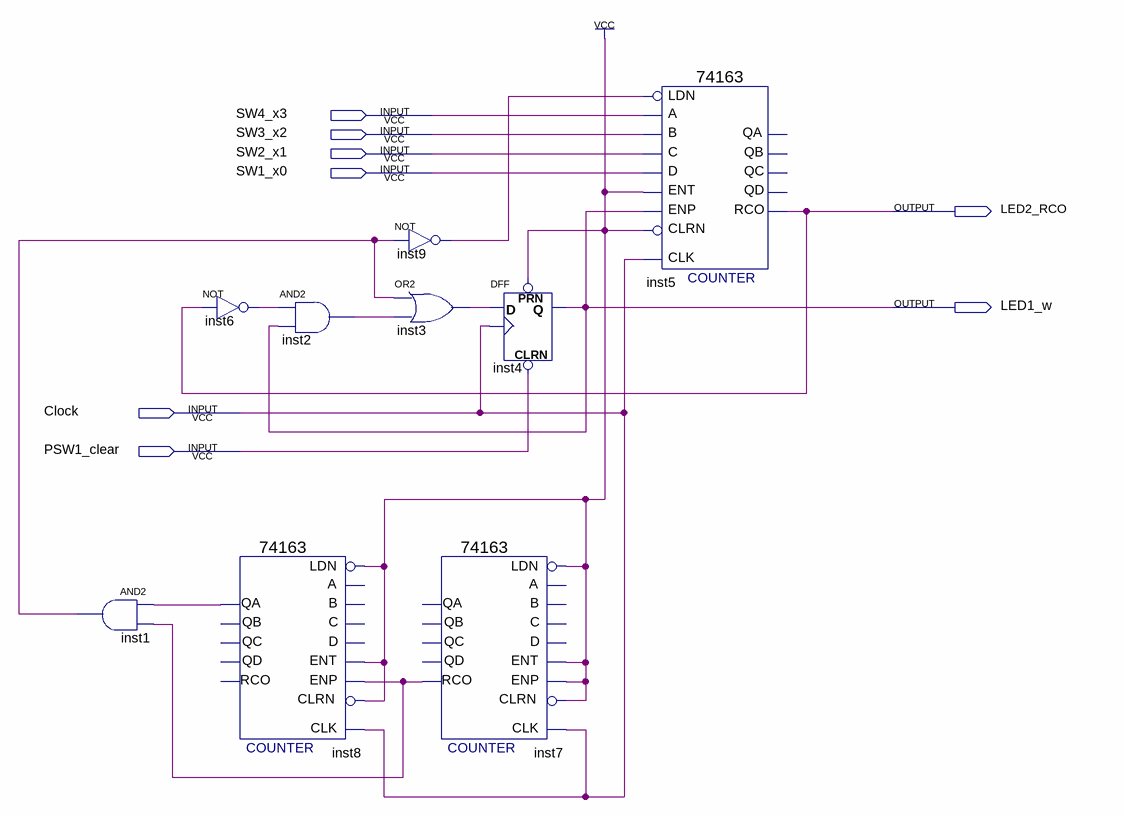
[diagram p0: schematic sheet]
// Quartus schematic q6_a.bdf as structural Verilog: 9 symbols, 8 pins
module q6_a (
  input  SW4_x3,
  input  SW3_x2,
  input  SW2_x1,
  input  SW1_x0,
  input  Clock,
  input  PSW1_clear,
  output LED2_RCO,
  output LED1_w
);

  wire inst1_out, inst2_out, inst3_out, inst6_out, inst7_rco, inst8_qa, inst9_out;

  and inst1 (inst1_out, inst8_qa, inst7_rco);
  not inst6 (inst6_out, LED2_RCO);
  \74163  inst8 (
    .ENT(1'b1), .CLRN(1'b1), .CLK(Clock), .ENP(inst7_rco), .LDN(1'b1), .QA(inst8_qa));  // open: C, B, A, D, QB, QC, QD, RCO
  and inst2 (inst2_out, inst6_out, LED1_w);
  not inst9 (inst9_out, inst1_out);
  or inst3 (inst3_out, inst1_out, inst2_out);
  \74163  inst7 (
    .ENT(1'b1), .CLRN(1'b1), .CLK(Clock), .ENP(1'b1), .LDN(1'b1), .RCO(inst7_rco));  // open: C, B, A, D, QA, QB, QC, QD
  DFF inst4 (.CLRN(PSW1_clear), .CLK(Clock), .D(inst3_out), .PRN(1'b1), .Q(LED1_w));
  \74163  inst5 (
    .C(SW2_x1), .B(SW3_x2), .A(SW4_x3), .ENT(1'b1), .D(SW1_x0), .CLRN(1'b1), .CLK(Clock), .ENP(LED1_w),
    .LDN(inst9_out), .RCO(LED2_RCO));  // open: QA, QB, QC, QD
endmodule
